# EAGLE schematic powerSwitch009 (EAGLE 5.12)

## Sheet 1 of 2
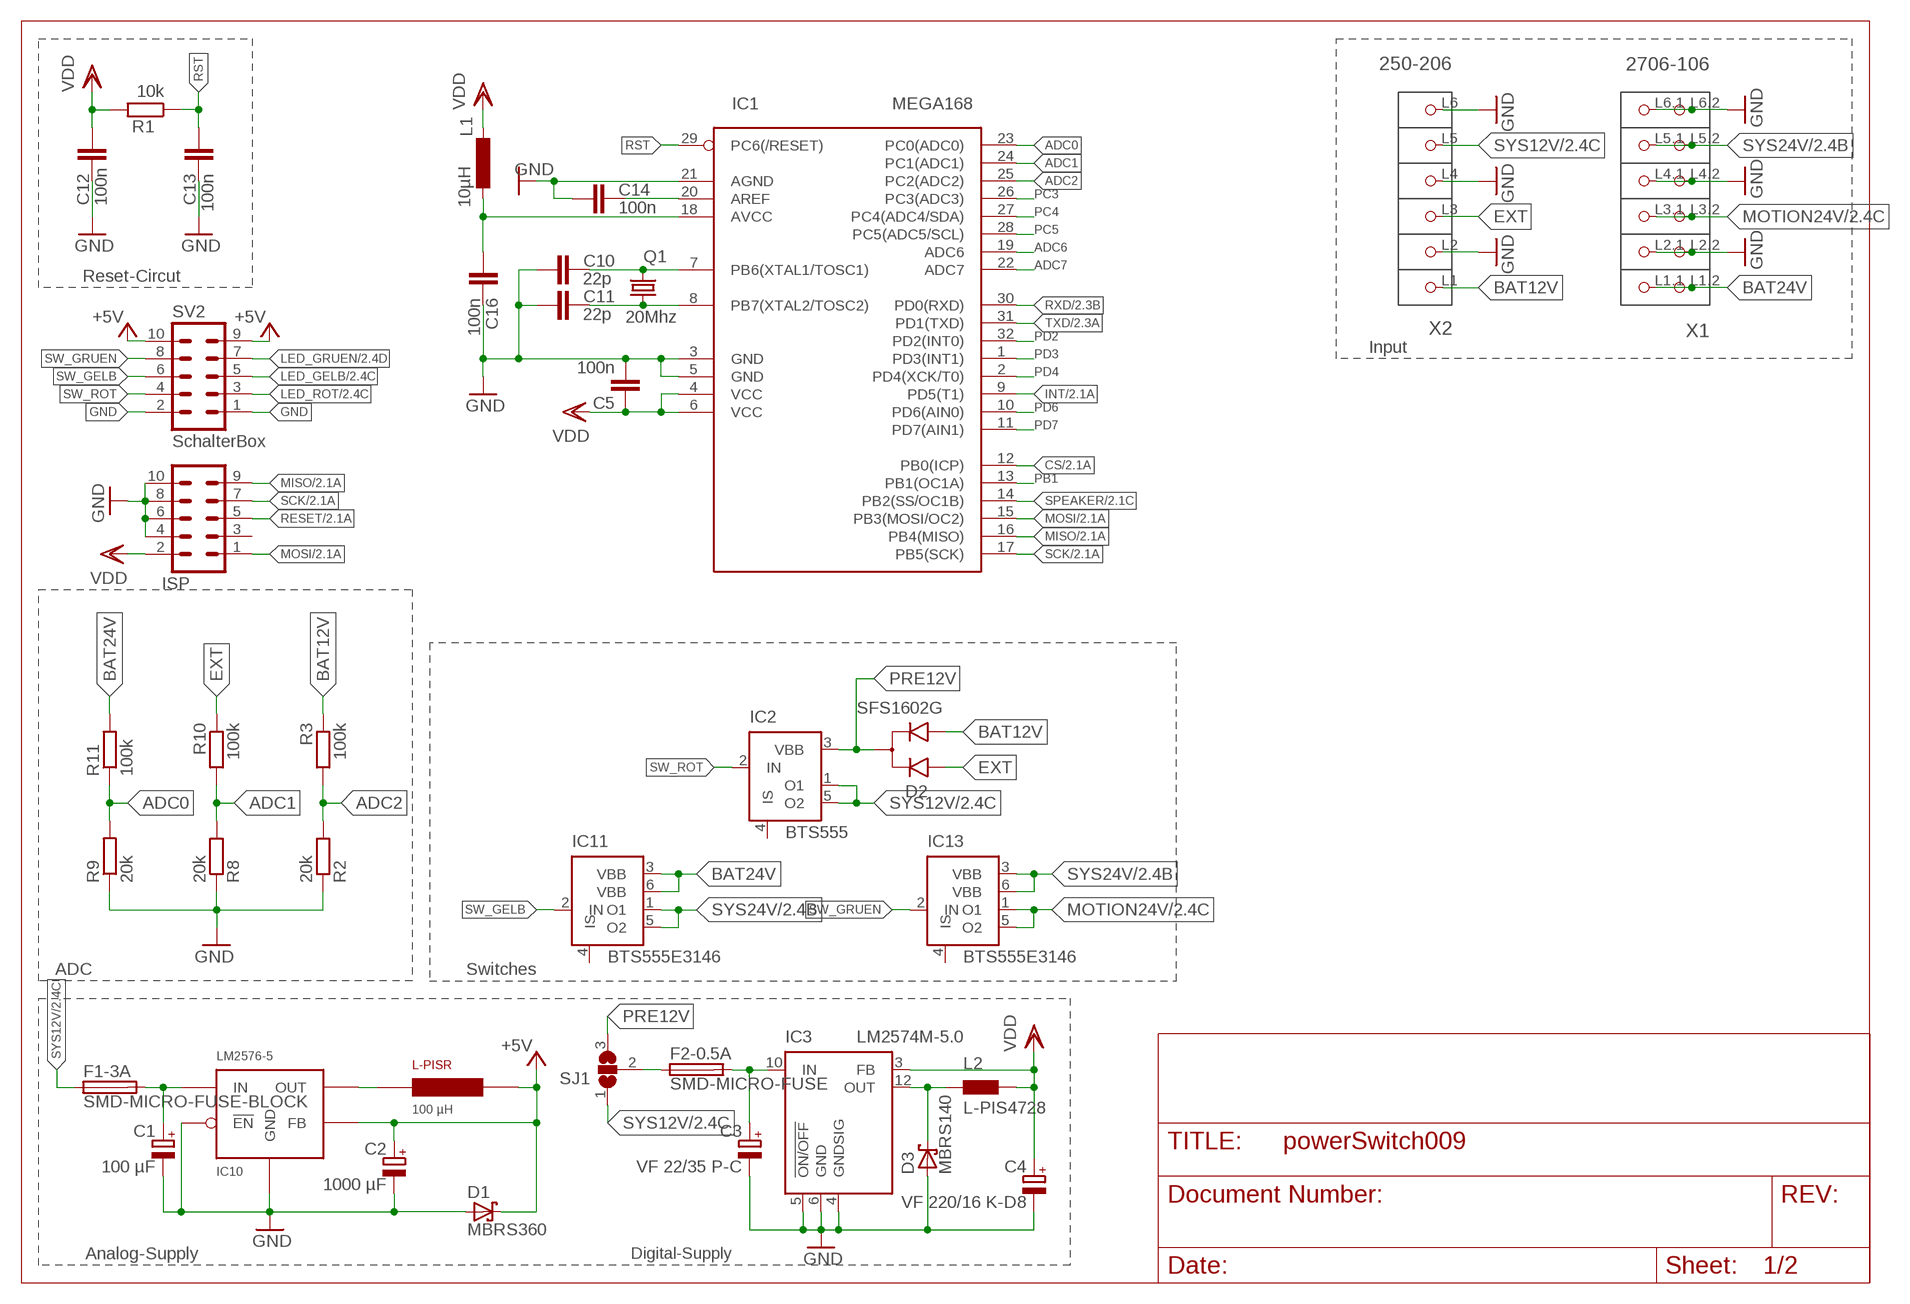
[diagram p0: schematic, sheet 1]

### Parts
C1  100 µF  CPOL-EUD  [PANASONIC_D]
C2  1000 µF  CPOL-EUG  [PANASONIC_G]
C3  VF 22/35 P-C  CPOL-EUC  [PANASONIC_C]
C4  VF 220/16 K-D8  CPOL-EUD  [PANASONIC_D]
C5  100n  C-EUC0603K  [C0603K]
C10  22p  C-EUC0603K  [C0603K]
C11  22p  C-EUC0603K  [C0603K]
C12  100n  C-EUC0603K  [C0603K]
C13  100n  C-EUC0603K  [C0603K]
C14  100n  C-EUC0603K  [C0603K]
C16  100n  C-EUC0603K  [C0603K]
D1  MBRS360  MBRS340T3  [SMC]
D2  SFS1602G  SFS160G  [D2PAK]
D3  MBRS140  SCHOTTKY-DIODESMD  [SMB]
F1-3A  SMD-MICRO-FUSE-BLOCK  [OMNIBLOK]
F2-0.5A  SMD-MICRO-FUSE  [SMD-6,1X2,6]
IC1  MEGA168  MEGA8-AI  [TQFP32-08]
IC2  BTS555  [TO220-51]
IC3  LM2574M-5.0  [SO14W]
IC10  LM2576-5  LM2576-T05D  [TO220-5_STAGGERED]
IC11  BTS555E3146  [TO220-52]
IC13  BTS555E3146  [TO220-52]
ISP  socket  ML10L  [ML10L]
L1  10µH  L-EU-0805L0805  [R0805]
L2  L-PIS4728  PIS4728  [PIS4728]
L-PISR  100 µH  PISR  [PISR]
Q1  20Mhz  CRYTALHC49U-V  [HC49U-V]
R1  10k  R-EU_R0805  [R0805]
R2  20k  R-EU_R0805  [R0805]
R3  100k  R-EU_R0805  [R0805]
R8  20k  R-EU_R0805  [R0805]
R9  20k  R-EU_R0805  [R0805]
R10  100k  R-EU_R0805  [R0805]
R11  100k  R-EU_R0805  [R0805]
SJ1  SJ2W  [SJ_2]
SV2  SchalterBox  ML10  [ML10]
X1  2706-106  [P-2706-106]
X2  250-206  [P-250-206]

### Nets
+5V: C2.+ D1.C IC10.FB L-PISR.P$2 SV2.9 SV2.10 ; also sheet 2
ADC0: IC1.23(PC0(ADC0)) R9.2 R11.1
ADC1: IC1.24(PC1(ADC1)) R8.2 R10.2
ADC2: IC1.25(PC2(ADC2)) R2.2 R3.2
ADC6: IC1.19(ADC6)
ADC7: IC1.22(ADC7)
BAT12V: D2.P$2 R3.1 X2.L1(P1)
BAT24V: IC11.3(VBB) IC11.6(VBB) R11.2 X1.L1.1(P1.1) X1.L1.2(P1.2)
CS: IC1.12(PB0(ICP)) ; also sheet 2
EXT: D2.P$1 R10.1 X2.L3(P3)
GND: C1.- C2.- C3.- C4.- C5.2 C10.1 C11.1 C12.1 C13.1 C14.1 C16.2 D1.A D3.A IC1.3(GND) IC1.5(GND) IC1.21(AGND) IC3.4(GNDSIG) IC3.5(!ON/OFF) IC3.6(GND) IC10.!EN IC10.GND ISP.4 ISP.6 ISP.8 ISP.10 R2.1 R8.1 R9.1 SV2.1 SV2.2 X1.L2.1(P2.1) X1.L2.2(P2.2) X1.L4.1(P4.1) X1.L4.2(P4.2) X1.L6.1(P6.1) X1.L6.2(P6.2) X2.L2(P2) X2.L4(P4) X2.L6(P6) ; also sheet 2
INT: IC1.9(PD5(T1)) ; also sheet 2
LED_GELB: SV2.5 ; also sheet 2
LED_GRUEN: SV2.7 ; also sheet 2
LED_ROT: SV2.3 ; also sheet 2
MISO: IC1.16(PB4(MISO)) ISP.9 ; also sheet 2
MOSI: IC1.15(PB3(MOSI/OC2)) ISP.1 ; also sheet 2
MOTION24V: IC13.1(O1) IC13.5(O2) X1.L3.1(P3.1) X1.L3.2(P3.2) ; also sheet 2
N$9: IC10.OUT L-PISR.P$1
N$10: C10.2 IC1.7(PB6(XTAL1/TOSC1)) Q1.2
N$11: C11.2 IC1.8(PB7(XTAL2/TOSC2)) Q1.1
N$13: C14.2 IC1.20(AREF)
N$14: C16.1 IC1.18(AVCC) L1.1
N$19: C1.+ F1-3A.P$2 IC10.IN
N$22: C3.+ F2-0.5A.2 IC3.10(IN)
N$63: F2-0.5A.1 SJ1.2
N$64: D3.C IC3.12(OUT) L2.P$1
PB1: IC1.13(PB1(OC1A))
PC3: IC1.26(PC3(ADC3))
PC4: IC1.27(PC4(ADC4/SDA))
PC5: IC1.28(PC5(ADC5/SCL))
PD2: IC1.32(PD2(INT0))
PD3: IC1.1(PD3(INT1))
PD4: IC1.2(PD4(XCK/T0))
PD6: IC1.10(PD6(AIN0))
PD7: IC1.11(PD7(AIN1))
PRE12V: D2.P$3 IC2.3(VBB) SJ1.3
RESET: ISP.5 ; also sheet 2
RST: C13.2 IC1.29(PC6(/RESET)) R1.1
RXD: IC1.30(PD0(RXD)) ; also sheet 2
SCK: IC1.17(PB5(SCK)) ISP.7 ; also sheet 2
SPEAKER: IC1.14(PB2(SS/OC1B)) ; also sheet 2
SW_GELB: IC11.2(IN) SV2.6
SW_GRUEN: IC13.2(IN) SV2.8
SW_ROT: IC2.2(IN) SV2.4
SYS12V: F1-3A.P$1 IC2.1(O1) IC2.5(O2) SJ1.1 X2.L5(P5) ; also sheet 2
SYS24V: IC11.1(O1) IC11.5(O2) IC13.3(VBB) IC13.6(VBB) X1.L5.1(P5.1) X1.L5.2(P5.2) ; also sheet 2
TXD: IC1.31(PD1(TXD)) ; also sheet 2
VDD: C4.+ C5.1 C12.2 IC1.4(VCC) IC1.6(VCC) IC3.3(FB) ISP.2 L1.2 L2.P$2 R1.2 ; also sheet 2
Unconnected: IC2.4(IS) IC11.4(IS) IC13.4(IS) ISP.3

### Notes on the sheet
- Reset-Circut
- Input
- ADC | Switches
- Analog-Supply | Digital-Supply

## Sheet 2 of 2
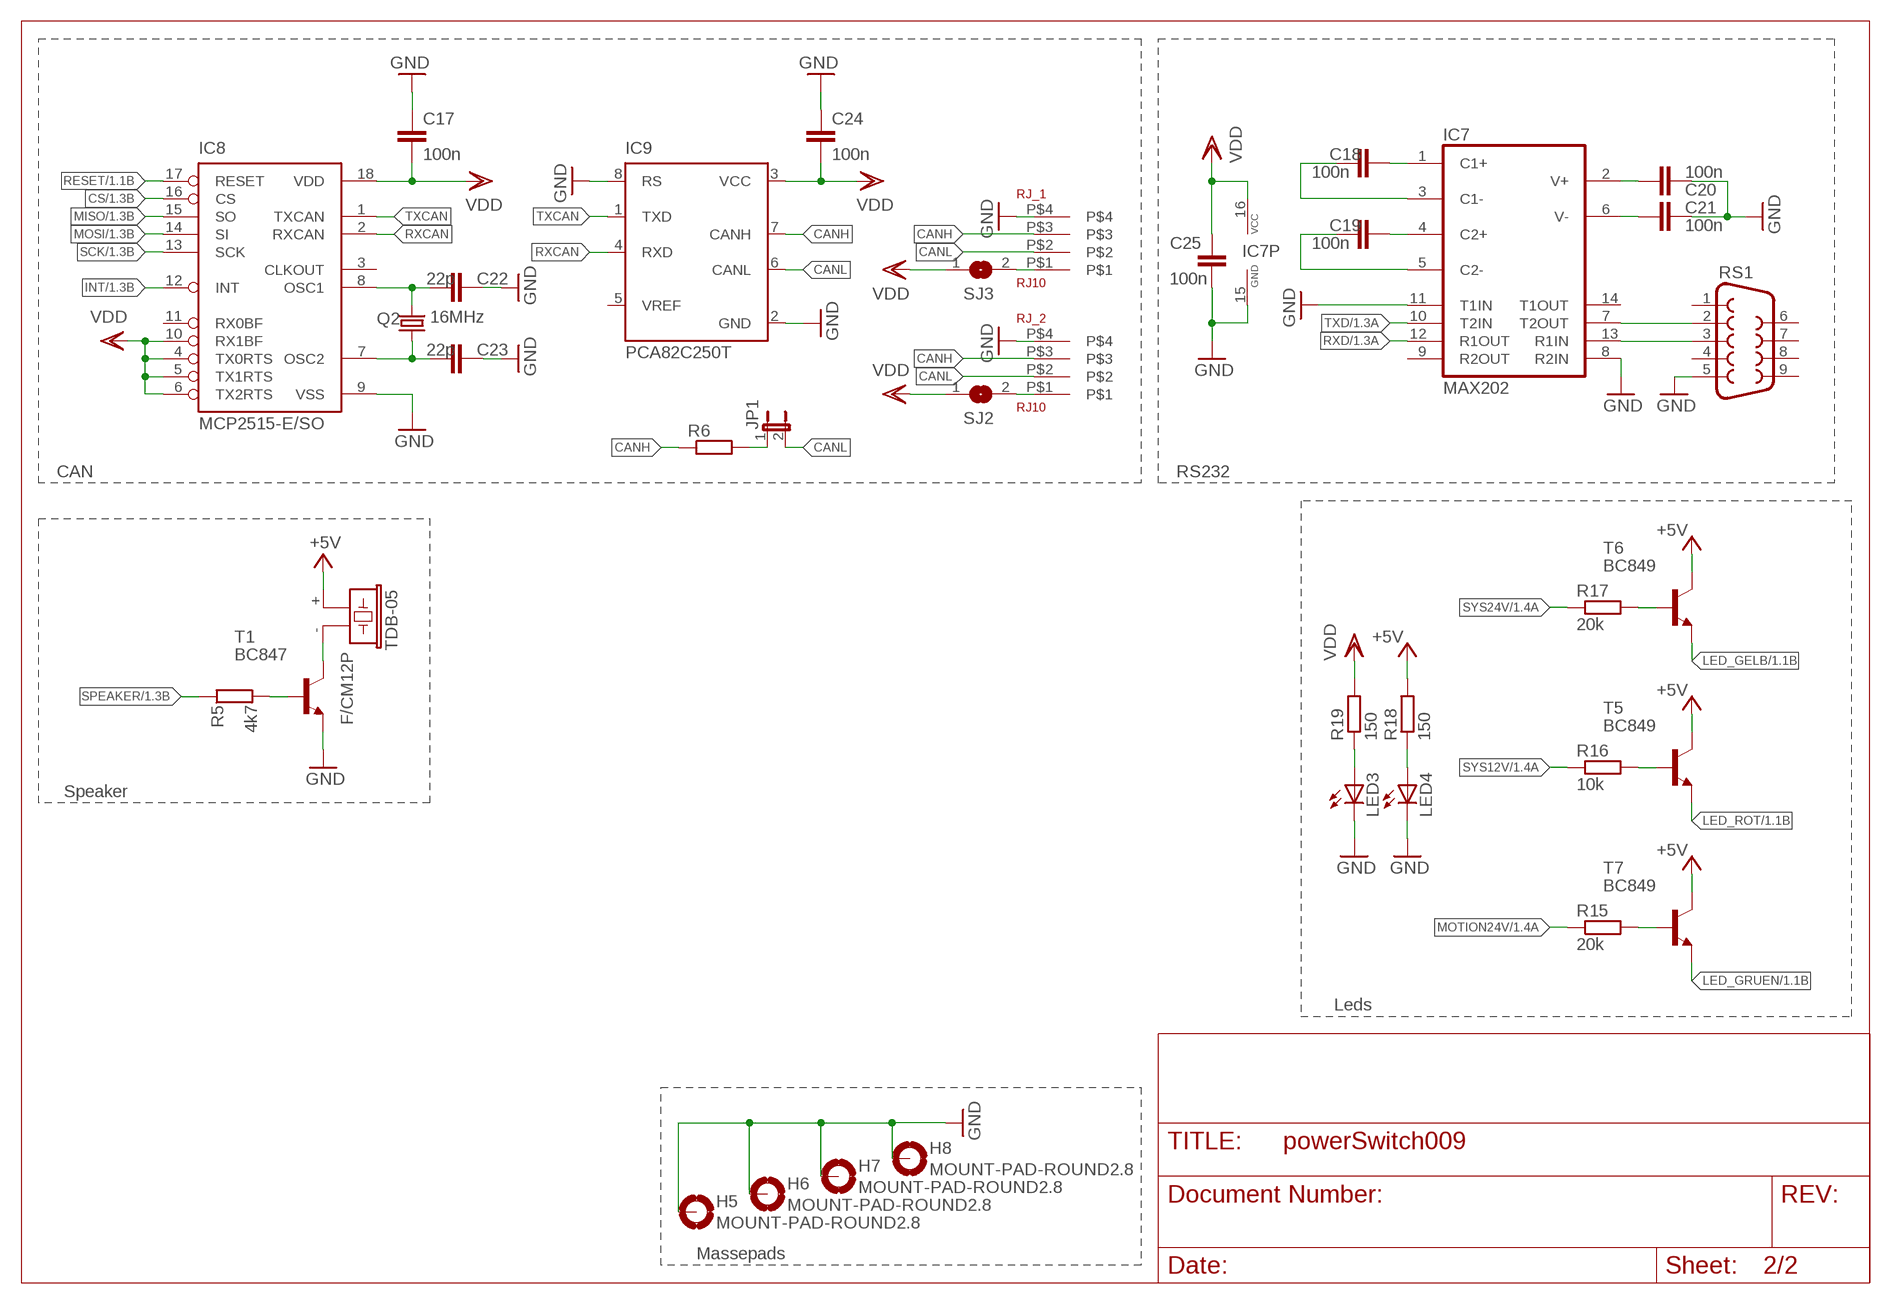
[diagram p1: schematic, sheet 2]

### Parts
C17  100n  C-EUC0603  [C0603]
C18  100n  C-EUC0603K  [C0603K]
C19  100n  C-EUC0603K  [C0603K]
C20  100n  C-EUC0603K  [C0603K]
C21  100n  C-EUC0603K  [C0603K]
C22  22p  C-EUC0603  [C0603]
C23  22p  C-EUC0603  [C0603]
C24  100n  C-EUC0603  [C0603]
C25  100n  C-EUC0603K  [C0603K]
H5  MOUNT-PAD-ROUND2.8  [2,8-PAD]
H6  MOUNT-PAD-ROUND2.8  [2,8-PAD]
H7  MOUNT-PAD-ROUND2.8  [2,8-PAD]
H8  MOUNT-PAD-ROUND2.8  [2,8-PAD]
IC7  MAX202  MAX3232CSE  [SO16]
IC8  MCP2515-E/SO  [SO18L]
IC9  PCA82C250T  [SO8]
JP1  JP1E  [JP1]
LED3  LEDCHIPLED_0805  [CHIPLED_0805]
LED4  LEDCHIPLED_0805  [CHIPLED_0805]
Q2  16MHz  CRYSTALHC49U-V  [HC49U-V]
R5  4k7  R-EU_R0805  [R0805]
R6  R-EU_M0805  [M0805]
R15  20k  R-EU_R0805  [R0805]
R16  10k  R-EU_R0805  [R0805]
R17  20k  R-EU_R0805  [R0805]
R18  150  R-EU_R0805  [R0805]
R19  150  R-EU_R0805  [R0805]
RJ_1  RJ10  [RJ10]
RJ_2  RJ10  [RJ10]
RS1  socket  F09HP  [F09HP]
SJ2  SJ  [SJ]
SJ3  SJ  [SJ]
T1  BC847  [SOT23]
T5  BC849  [SOT23]
T6  BC849  [SOT23]
T7  BC849  [SOT23]
TDB-05  F/CM12P  [F/CM12P]

### Nets
+5V: R18.2 T5.3(C) T6.3(C) T7.3(C) TDB-05.+ ; also sheet 1
CANH: IC9.7(CANH) R6.1 RJ_1.P$3 RJ_2.P$3
CANL: IC9.6(CANL) JP1.2 RJ_1.P$2 RJ_2.P$2
CS: IC8.16(CS) ; also sheet 1
GND: C17.1 C20.2 C21.2 C22.2 C23.2 C24.1 C25.2 H5.B2,8(MOUNT) H6.B2,8(MOUNT) H7.B2,8(MOUNT) H8.B2,8(MOUNT) IC7.8(R2IN) IC7.11(T1IN) IC7.15(GND) IC8.9(VSS) IC9.2(GND) IC9.8(RS) LED3.C LED4.C RJ_1.P$4 RJ_2.P$4 RS1.5 T1.2(E) ; also sheet 1
INT: IC8.12(INT) ; also sheet 1
LED_GELB: T6.2(E) ; also sheet 1
LED_GRUEN: T7.2(E) ; also sheet 1
LED_ROT: T5.2(E) ; also sheet 1
MISO: IC8.15(SO) ; also sheet 1
MOSI: IC8.14(SI) ; also sheet 1
MOTION24V: R15.1 ; also sheet 1
N$1: R5.2 T1.1(B)
N$2: RJ_1.P$1 SJ3.2
N$4: RJ_2.P$1 SJ2.2
N$7: JP1.1 R6.2
N$15: C18.2 IC7.1(C1+)
N$18: C19.2 IC7.4(C2+)
N$20: T1.3(C) TDB-05.-
N$32: C22.1 IC8.8(OSC1) Q2.2
N$34: C23.1 IC8.7(OSC2) Q2.1
N$35: C18.1 IC7.3(C1-)
N$36: C19.1 IC7.5(C2-)
N$37: C20.1 IC7.2(V+)
N$38: C21.1 IC7.6(V-)
N$40: IC7.13(R1IN) RS1.3
N$41: IC7.7(T2OUT) RS1.2
N$102: R16.2 T5.1(B)
N$104: R17.2 T6.1(B)
N$106: R15.2 T7.1(B)
N$108: LED4.A R18.1
N$310: LED3.A R19.1
RESET: IC8.17(RESET) ; also sheet 1
RXCAN: IC8.2(RXCAN) IC9.4(RXD)
RXD: IC7.12(R1OUT) ; also sheet 1
SCK: IC8.13(SCK) ; also sheet 1
SPEAKER: R5.1 ; also sheet 1
SYS12V: R16.1 ; also sheet 1
SYS24V: R17.1 ; also sheet 1
TXCAN: IC8.1(TXCAN) IC9.1(TXD)
TXD: IC7.10(T2IN) ; also sheet 1
VDD: C17.2 C24.2 C25.1 IC7.16(VCC) IC8.4(TX0RTS) IC8.5(TX1RTS) IC8.6(TX2RTS) IC8.10(RX1BF) IC8.18(VDD) IC9.3(VCC) R19.2 SJ2.1 SJ3.1 ; also sheet 1
Unconnected: IC7.9(R2OUT) IC7.14(T1OUT) IC8.3(CLKOUT) IC8.11(RX0BF) IC9.5(VREF) RS1.1 RS1.4 RS1.6 RS1.7 RS1.8 RS1.9

### Notes on the sheet
- CAN | RS232
- Speaker
- Leds
- Massepads

## Library data of the parts
C1-C4 = rcl:CPOL-EU: POLARIZED CAPACITOR, European symbol
C5 C10-C14 C16-C25 = rcl:C-EU: CAPACITOR, European symbol
D1 = diode:MBRS3*0T3: SCHOTTKY BARRIER RECTIFIER 3.0 AMPERES 20, 30, 40 VOLT Source: MBRS340T3-D.pdf
D2 = ownParts:SFS160*G
D3 = diode:SCHOTTKY-DIODE: Schottky Diode
F1-3A F2-0.5A = f-lf-omniblok-s:SMD-MICRO-FUSE
H5-H8 = holes:MOUNT-PAD-ROUND: MOUNTING PAD, round
IC1 = atmel:MEGA8: MICROCONTROLLER 8 Kbytes FLASH 1 kbytes SRAM 512 bytes EEPROM USART 6-channel 10 bit ADC 2-channel 8 bit ADC Source: avr.lbr
IC2 = infineon:BTS555: PROFET® Data Sheet BTS555 Source: http://www.infineon.com/upload/Document/cmc_upload/documents/011/8726/Datasheet_BTS555.pdf; MF: FARNELL; MPN: BTS555.; OC_FARNELL: 4109260; OC_NEWARK: 26H6766
IC3 = linear:LM2574?-*: SIMPLE SWITCHER 0.5A Step-Down Voltage Regulator Source: http://cache.national.com/ds/LM/LM2574.pdf
IC7 = maxim:MAX3232*: True RS-232 Transceivers 3.0V to 5.5V, Low-Power up to 1Mbps, Using Four 0.1µF External Capacitors Source: http://pdfserv.maxim-ic.com/en/ds/MAX3222-MAX3241.pdf
IC8 = mcp2515:MCP2515
IC9 = micro-philips:PCA82C250: CAN CONTROLLER INTERFACE
IC10 = to220-custom:LM2576-T05D: LM2576/LM2576HV Series SIMPLE SWITCHER® 3A Step-Down Voltage Regulator STAGGERED PACKAGE
IC11 IC13 = ownParts:BTS555: PROFET® Data Sheet BTS555 Source: http://www.infineon.com/upload/Document/cmc_upload/documents/011/8726/Datasheet_BTS555.pdf; OC_FARNELL: unknown; OC_NEWARK: unknown
ISP SV2 = con-harting-ml:ML10: HARTING; OC_FARNELL: unknown; OC_NEWARK: unknown
JP1 = jumper:JP1E: JUMPER
L1 = myrcl:L-EU-0805
L2 = inductor-fastron:PIS4728: Fastron SMD Power Inductors Source: http://www.fastrongroup.com/series/53/findProducts
L-PISR = inductor_FASTRON:PISR
LED3 LED4 = led:LED: LED OSRAM: - CHIPLED LG R971, LG N971, LY N971, LG Q971, LY Q971, LO R971, LY R971 LH N974, LH R974 LS Q976, LO Q976, LY Q976 LO Q996 - Hyper CHIPLED LW Q18S LB Q993, LB Q99A, LB R99A - SideLED LS A670, LO A670, LY A670, LG A670, LP A670 LB A673, LV A673, LT A673, LW A673 LH A674 LY A675 LS A676, LA A676, LO A676, LY A676, LW A676 LS A679, LY A679, LG A679 - Hyper Micro SIDELED® LS Y876, LA Y876, LO Y876, LY Y876 LT Y87S - SmartLED LW L88C, LW L88S LB L89C, LB L89S, LG L890 LS L89K, LO L89K, LY L89K LS L896, LA L896, LO L896, LY L896 - TOPLED LS T670, LO T670, LY T670, LG T670, LP T670 LSG T670, LSP T670, LSY T670, LOP T670, LYG T670 LG T671, LOG T671, LSG T671 LB T673, LV T673, LT T673, LW T673 LH T674 LS T676, LA T676, LO T676, LY T676, LB T676, LH T676, LSB T676, LW T676 LB T67C, LV T67C, LT T67C, LS T67K, LO T67K, LY T67K, LW E67C LS E67B, LA E67B, LO E67B, LY E67B, LB E67C, LV E67C, LT E67C LW T67C LS T679, LY T679, LG T679 LS T770, LO T770, LY T770, LG T770, LP T770 LB T773, LV T773, LT T773, LW T773 LH T774 LS E675, LA E675, LY E675, LS T675 LS T776, LA T776, LO T776, LY T776, LB T776 LHGB T686 LT T68C, LB T68C - Hyper Mini TOPLED® LB M676 - Mini TOPLED Santana® LG M470 LS M47K, LO M47K, LY M47K Source: http://www.osram.convergy.de LUXEON: - LUMILED® LXK2-PW12-R00, LXK2-PW12-S00, LXK2-PW14-U00, LXK2-PW14-V00 LXK2-PM12-R00, LXK2-PM12-S00, LXK2-PM14-U00 LXK2-PE12-Q00, LXK2-PE12-R00, LXK2-PE12-S00, LXK2-PE14-T00, LXK2-PE14-U00 LXK2-PB12-K00, LXK2-PB12-L00, LXK2-PB12-M00, LXK2-PB14-N00, LXK2-PB14-P00, LXK2-PB14-Q00 LXK2-PR12-L00, LXK2-PR12-M00, LXK2-PR14-Q00, LXK2-PR14-R00 LXK2-PD12-Q00, LXK2-PD12-R00, LXK2-PD12-S00 LXK2-PH12-R00, LXK2-PH12-S00 LXK2-PL12-P00, LXK2-PL12-Q00, LXK2-PL12-R00 Source: www.luxeon.com KINGBRIGHT: KA-3528ASYC Source: www.kingbright.com
Q1 = crystal:CRYTAL: CRYSTAL
Q2 = crystal:CRYSTAL: CRYSTAL
R1-R3 R5 R6 R8-R11 R15-R19 = rcl:R-EU_: RESISTOR, European symbol
RJ_1 RJ_2 = ownParts:RJ10
RS1 = con-subd:F09: SUB-D
SJ1 = jumper:SJ2W: SMD solder JUMPER
SJ2 SJ3 = jumper:SJ: SMD solder JUMPER
T1 = transistor:BC847: NPN TRANSISTOR
T5-T7 = transistor:BC849: NPN TRANSISTOR
TDB-05 = buzzer:F/CM12P: BUZZER Source: Buerklin; OC_FARNELL: unknown; OC_NEWARK: unknown
X1 = con-wago_2706:2706-106: Serie 2706, Klemmenleisten mit Betätigungshebeln 2 Lötstifte/Pol / Series 2706, Terminal strips with operating levers 2 solder pins/pole Polzahl / Pole No.: 6 Bemessungsspannung / Rated Voltage: 630 V Nennstrom / Nominal Current: 41 A Leiterquerschnitt / Conductor Size: 0.5 - 6 mm² Anschlusstechnik / Connection Technology: CAGE CLAMP® Lötstiftlänge: / Solder Pin Length: 4.5 mm Leitereinführung (zur Platine) / Conductor entry angle (to PCB): 30 ° Farbe / Color: grau / gray Stand: 01.01.2012. Die jeweils aktuellen Daten zu diesem Artikel finden Sie in unserem Produktkatalog, den Sie unter www.wago.com einsehen können. As of: 01/01/2012. Please find the newest data for this article in our product catalogue, which can be viewed under www.wago.com.
X2 = con-wago_250:250-206: Serie 250, 1-Leiter-Klemmenleiste für Leiterplatten 1 Lötstift/Pol versetzt / Series 250, 1-conductor PCB terminal strip 1 solder pin/pole, staggered Polzahl / Pole No.: 6 Rastermaß / Pitch: 3.5 mm Bemessungsspannung / Rated Voltage: 320 V Nennstrom / Nominal Current: 8 A Leiterquerschnitt / Conductor Size: 0.2 - 1.5 mm² Anschlusstechnik / Connection Technology: Steckklemm-Anschluss Lötstiftlänge: / Solder Pin Length: 3.6 mm Leitereinführung (zur Platine) / Conductor entry angle (to PCB): 45 ° Farbe / Color: grau / gray Stand: 01.01.2012. Die jeweils aktuellen Daten zu diesem Artikel finden Sie in unserem Produktkatalog, den Sie unter www.wago.com einsehen können. As of: 01/01/2012. Please find the newest data for this article in our product catalogue, which can be viewed under www.wago.com.